# EAGLE design Modular-LED-Lamp-Power-Control (EAGLE 7.7.0)
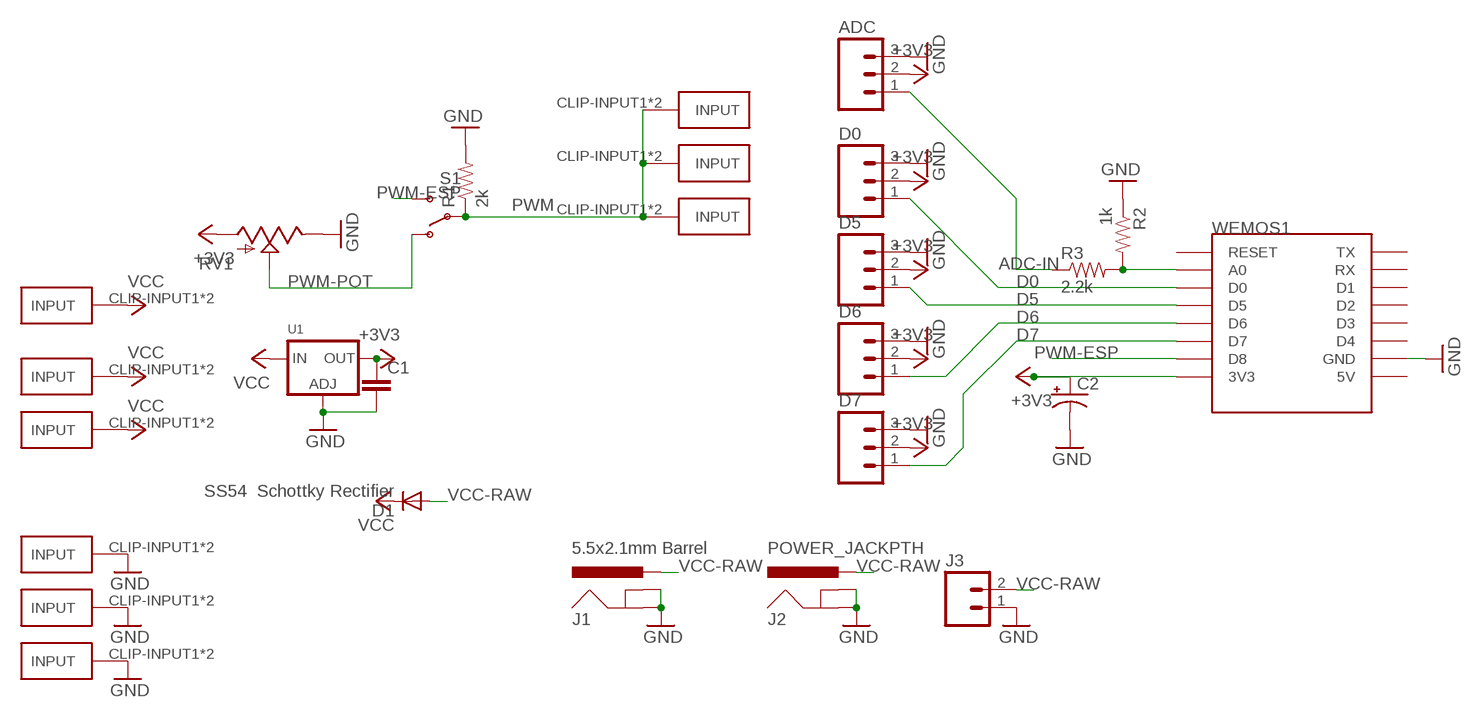
[diagram p0: schematic, sheet 1]

## Parts
ADC  M03PTH  [1X03]
C1  CAP1206  [1206]
C2  CAP_POLE  [PANASONIC_E]
D0  M03PTH  [1X03]
D1  SS54 Schottky Rectifier  S3A  [DO214AB]
D5  M03PTH  [1X03]
D6  M03PTH  [1X03]
D7  M03PTH  [1X03]
GND-CLIP  GND  FUSE-HOLDER-5X20MM  [FUSE-HOLDER-5X20MM]
GND-CLIP1  GND  FUSE-HOLDER-5X20MM  [FUSE-HOLDER-5X20MM]
GND-CLIP2  GND  FUSE-HOLDER-5X20MM  [FUSE-HOLDER-5X20MM]
J1  5.5x2.1mm Barrel  POWER_JACKSMD  [POWER_JACK_SMD]
J2  POWER_JACKPTH  [POWER_JACK_PTH]
J3  M025MM  [SCREWTERMINAL-5MM-2]
PWM-CLIP  FUSE-HOLDER-5X20MM  [FUSE-HOLDER-5X20MM]
PWM-CLIP1  FUSE-HOLDER-5X20MM  [FUSE-HOLDER-5X20MM]
PWM-CLIP2  FUSE-HOLDER-5X20MM  [FUSE-HOLDER-5X20MM]
R1  2k  RESISTOR1206  [1206]
R2  1k  RESISTOR1206  [1206]
R3  2.2k  RESISTOR1206  [1206]
RV1  POT-RV16AF-20  [POT_ALPHA_RV16AF-20]
S1  SWITCH-SPDTPTH  [SWITCH-SPDT]
U1  LM1117SOT223-WAVE  [SOT223-W]
VCC-CLIP  FUSE-HOLDER-5X20MM  [FUSE-HOLDER-5X20MM]
VCC-CLIP1  FUSE-HOLDER-5X20MM  [FUSE-HOLDER-5X20MM]
VCC-CLIP2  FUSE-HOLDER-5X20MM  [FUSE-HOLDER-5X20MM]
WEMOS1  WEMOS-D1-MINI  [WEMOS-D1-MINI]

## Nets
+3V3: ADC.2 C1.1 C2.+ D0.2 D5.2 D6.2 D7.2 RV1.1(A) U1.2(OUT) WEMOS1.3V3
A0: R2.2 R3.2 WEMOS1.A0
ADC-IN: ADC.1 R3.1
D0: D0.1 WEMOS1.D0
D5: D5.1 WEMOS1.D5
D6: D6.1 WEMOS1.D6
D7: D7.1 WEMOS1.D7
GND: ADC.3 C1.2 C2.- D0.3 D5.3 D6.3 D7.3 GND-CLIP1.CLIP-INPUT1(INPUT) GND-CLIP1.CLIP-INPUT2(INPUT) GND-CLIP2.CLIP-INPUT1(INPUT) GND-CLIP2.CLIP-INPUT2(INPUT) GND-CLIP.CLIP-INPUT1(INPUT) GND-CLIP.CLIP-INPUT2(INPUT) J1.GND(GNDBREAK) J1.P$4(GND) J2.GND J2.GNDBREAK J3.1 R1.2 R2.1 RV1.3(E) U1.1(ADJ) WEMOS1.GND
PWM: PWM-CLIP1.CLIP-INPUT1(INPUT) PWM-CLIP1.CLIP-INPUT2(INPUT) PWM-CLIP2.CLIP-INPUT1(INPUT) PWM-CLIP2.CLIP-INPUT2(INPUT) PWM-CLIP.CLIP-INPUT1(INPUT) PWM-CLIP.CLIP-INPUT2(INPUT) R1.1 S1.2(P)
PWM-ESP: S1.3(S) WEMOS1.D8
PWM-POT: RV1.2(S) S1.1(O)
VCC: D1.C U1.3(IN) VCC-CLIP1.CLIP-INPUT1(INPUT) VCC-CLIP1.CLIP-INPUT2(INPUT) VCC-CLIP2.CLIP-INPUT1(INPUT) VCC-CLIP2.CLIP-INPUT2(INPUT) VCC-CLIP.CLIP-INPUT1(INPUT) VCC-CLIP.CLIP-INPUT2(INPUT)
VCC-RAW: D1.A J1.VIN0(PWR) J2.PWR J3.2
Unconnected: WEMOS1.5V WEMOS1.D1 WEMOS1.D2 WEMOS1.D3 WEMOS1.D4 WEMOS1.RESET WEMOS1.RX WEMOS1.TX

## Library data of the parts
ADC D0 D5-D7 = SparkFun-Connectors:M03: Header 3 Standard 3-pin 0.1" header. Use with straight break away headers (SKU : PRT-00116), right angle break away headers (PRT-00553), swiss pins (PRT-00743), machine pins (PRT-00117), and female headers (PRT-00115). Molex polarized connector foot print use with SKU : PRT-08232 with associated crimp pins and housings.
C1 = SparkFun-Capacitors:CAP: Capacitor Standard 0603 ceramic capacitor, and 0.1" leaded capacitor.
C2 = SparkFun-Capacitors:CAP_POL: Capacitor Polarized These are standard SMD and PTH capacitors. Normally 10uF, 47uF, and 100uF in electrolytic and tantalum varieties. Always verify the external diameter of the through hole cap, it varies with capacity, voltage, and manufacturer. The EIA devices should be standard.
D1 = s3x_10:S3*: S3A - S3N General Purpose Rectifiers Source: http://www.fairchildsemi.com/datasheets/S3/S3A.pdf; MF: Fairchild; MPN: S3A; OC_FARNELL: 1017803; OC_NEWARK: 58K2395
GND-CLIP GND-CLIP1 GND-CLIP2 PWM-CLIP PWM-CLIP1 PWM-CLIP2 VCC-CLIP VCC-CLIP1 VCC-CLIP2 = timon-diverses:FUSE-HOLDER-5X20MM
J1 = SparkFun-Connectors:POWER_JACK: Power Jack This is the standard 5.5mm barrel jack for power. The PTH is the most common, proven, reliable, footprint. The Slot footprint only works if the mill layer is transmitted to the PCB fab house so be warned. Mating wall wart : TOL-00298 (and others); PROD_ID: CONN-08106; SF_ID: PRT-12748
J2 = SparkFun-Connectors:POWER_JACK: Power Jack This is the standard 5.5mm barrel jack for power. The PTH is the most common, proven, reliable, footprint. The Slot footprint only works if the mill layer is transmitted to the PCB fab house so be warned. Mating wall wart : TOL-00298 (and others); PROD_ID: CONN-08197
J3 = SparkFun-Connectors:M02: Standard 2-pin 0.1" header. Use with - straight break away headers ( PRT-00116) - right angle break away headers (PRT-00553) - swiss pins (PRT-00743) - machine pins (PRT-00117) - female headers (PRT-00115) Molex polarized connector foot print use with: PRT-08233 with associated crimp pins and housings. 2.54_SCREWTERM for use with PRT-10571. 3.5mm Screw Terminal footprints for PRT-08084 5mm Screw Terminal footprints for use with PRT-08432; STOREFRONT_ID: PRT-08432
R1-R3 = SparkFun-Resistors:RESISTOR: Resistor Basic schematic elements and footprints for 0603, 1206, and PTH resistors.
RV1 = SparkFun-Electromechanical:POT
S1 = SparkFun-Electromechanical:SWITCH-SPDT: SPDT Switch Simple slide switch, Spark Fun Electronics SKU : COM-00102 DPDT SMT slide switch, AYZ0202, SWCH-08179; PROD_ID: SWCH-08261
U1 = microbuilder:LM1117: LM1117 Voltage Regulator LM1117 Adjustable Voltage regulator [Digikey: LM1117IMP-ADJDKR-ND] LM1117 3.3V Voltage regulator [AP1117E33GDIDKR-ND] LM1117 5.0V Voltage regulator [AP1117E50GDIDKR-ND] SOT223-REFLOW - SOT223 package for solder paste/reflow ovens SOT223-WAVE - SOT223 package for hand-soldering (larger pads) Note: For the fixed-voltage regulators, simply set the ADJ pin to GND.
WEMOS1 = esp8266modules:WEMOS-D1-MINI: WeMos.cc D1 mini ESP8266 module

## Board
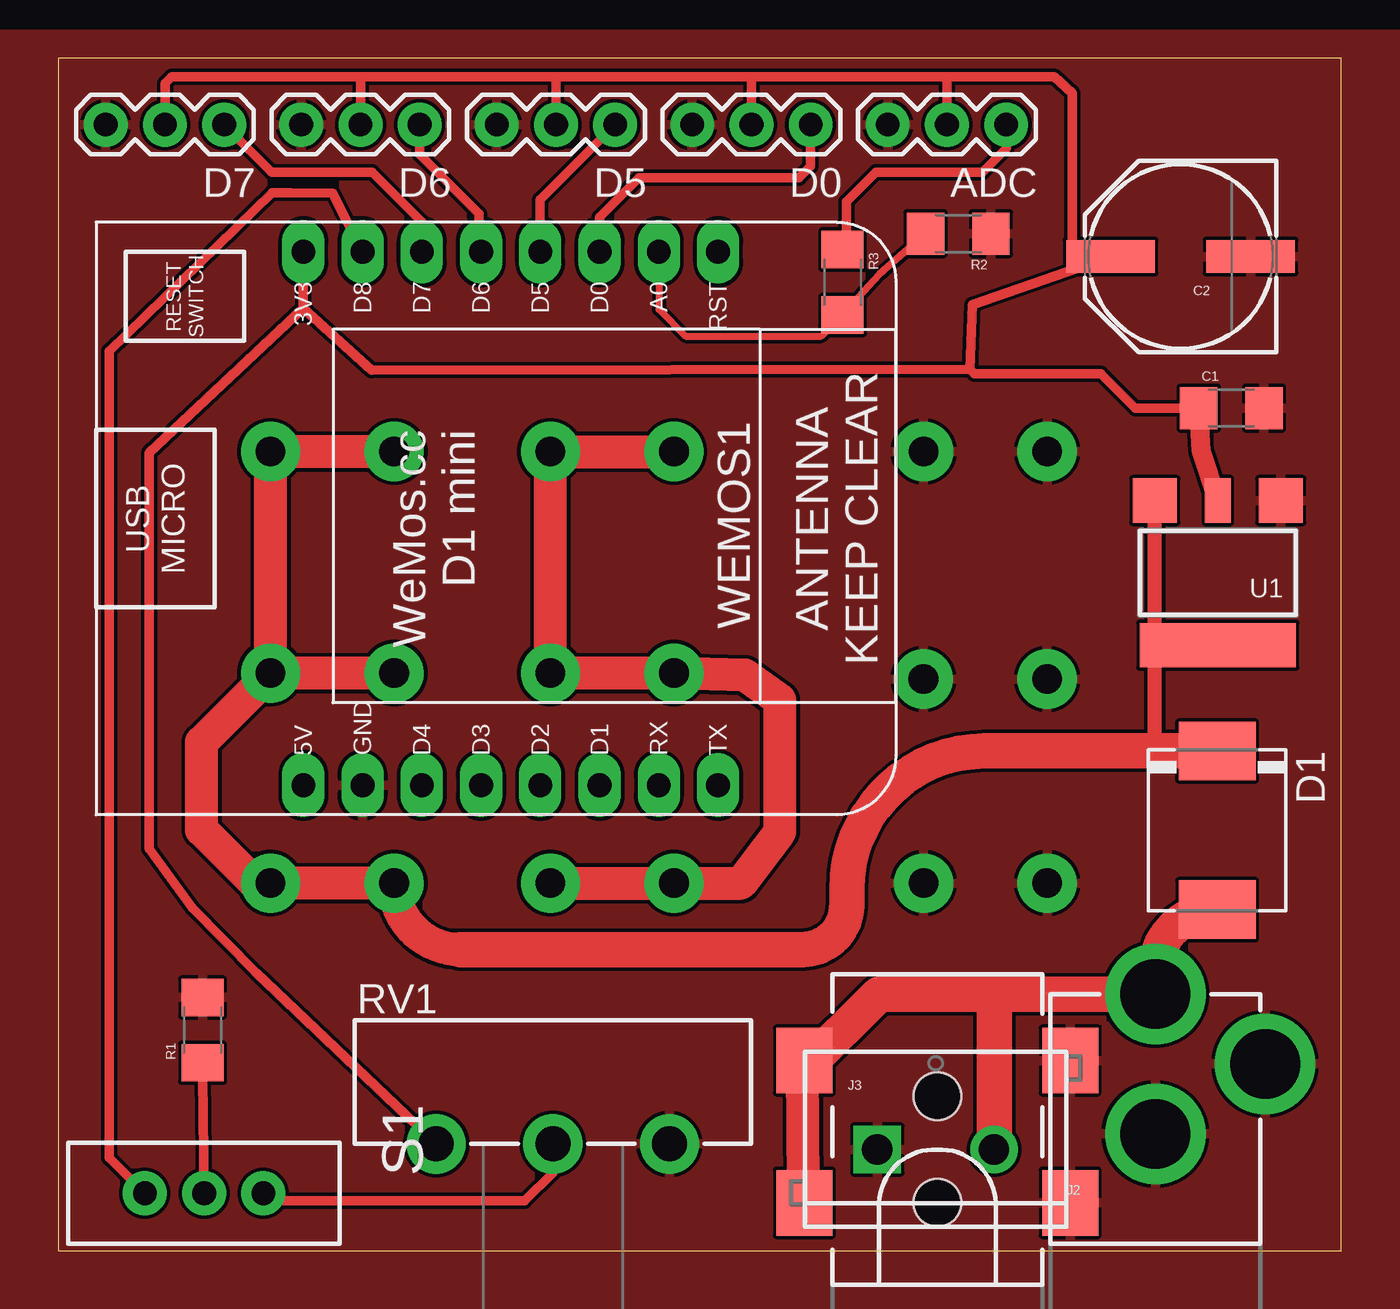
[diagram p1: board, top side]
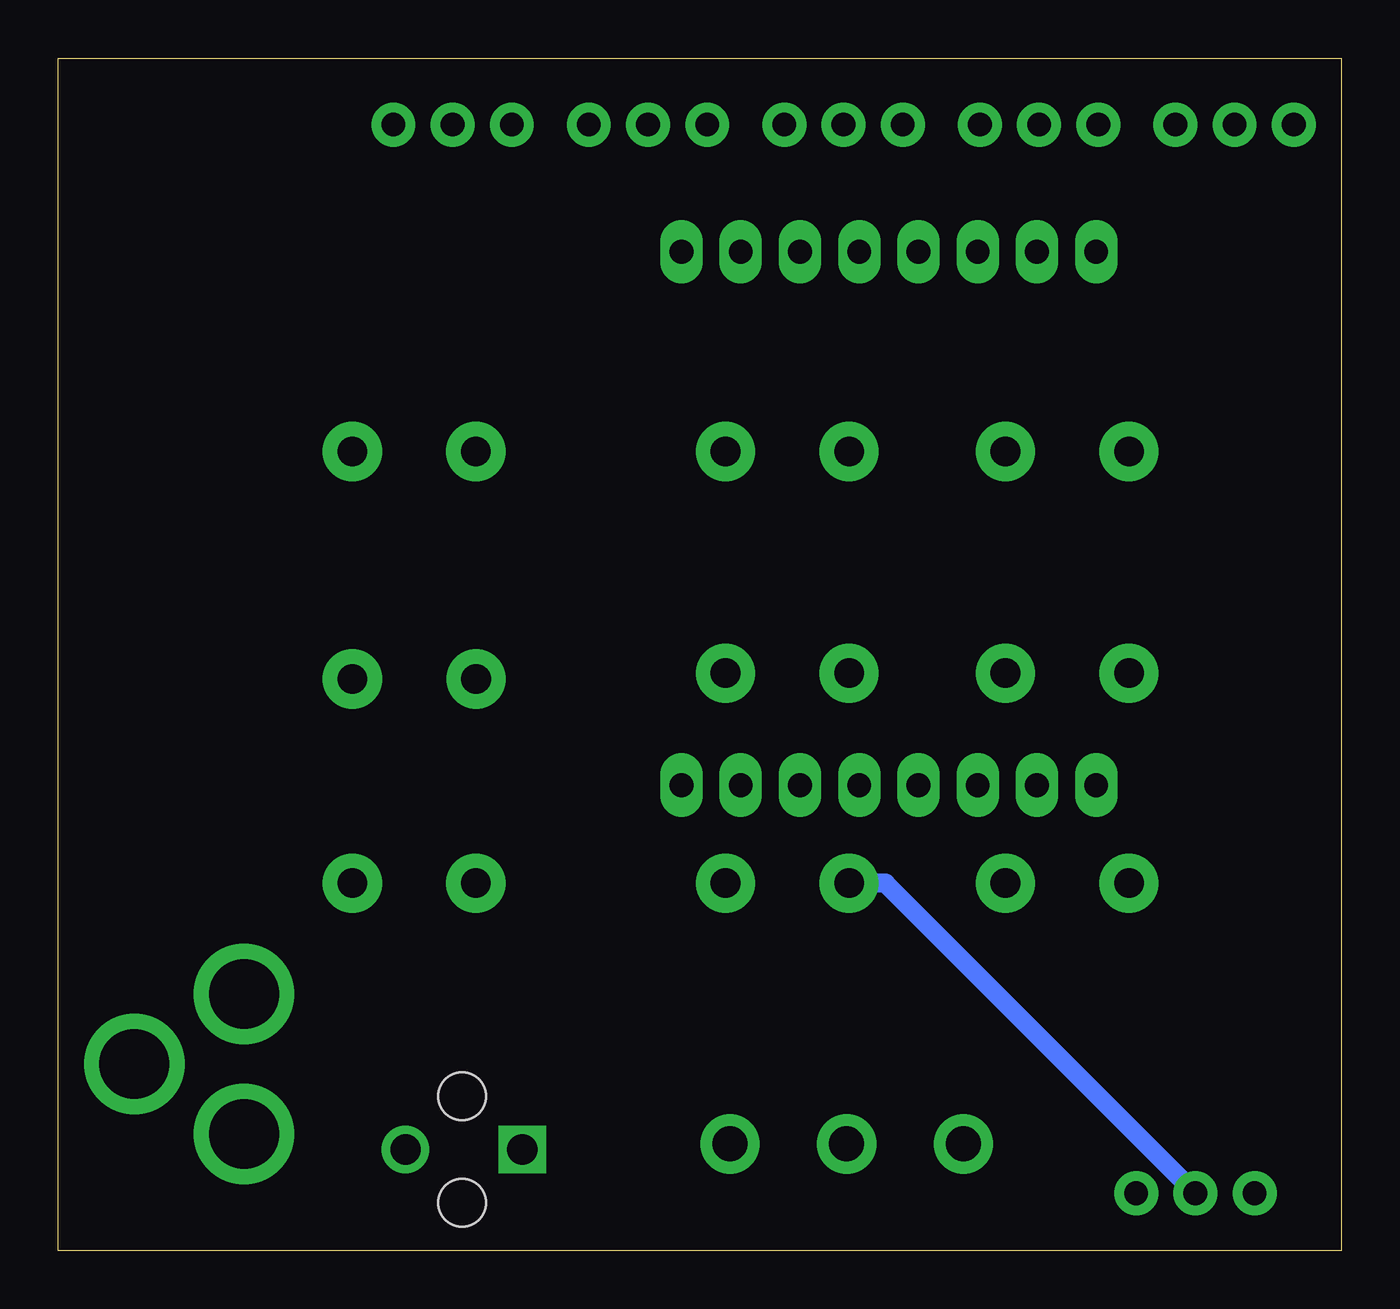
[diagram p2: board, bottom side, seen from below]

Size 55 x 51.1 mm. Coordinates in mm from the lower left corner, seen from the top.
Outline: 0,0 55,0 55,51.1 0,51.1 0,0
Copper layers (1*16): Top 0.035mm / dielectric 1.5mm / Bottom 0.035mm
Design rules "OthermillDRC_30_deg_v2": minimum track width 6mil, minimum drill 0.8mm, track to track 6mil, track to pad 6mil, pad to pad 6mil, via to via 6mil, smd to smd 0mil, copper to edge 0mil, drill to drill 6mil, minimum pad ring 10mil, minimum via ring 10mil, stop-mask expansion 1mil, vias tented up to drill 30mil, thermal gap 6mil

### Footprints (pad centres in the part's own frame; a part is rotated, then mirrored left to right if it is on the bottom)
1X03 = drill 1.016 pad 1.88: 1 0,0; 2 2.54,0; 3 5.08,0
1206 = smd 1.6 x 1.8: 1 -1.4,0; 2 1.4,0
PANASONIC_E = smd 3.8 x 1.4: + 3,0; - -3,0
DO214AB = smd 2.5 x 3.3: A 3.4,0; C -3.4,0
FUSE-HOLDER-5X20MM = drill 1.27 pad 2.54: CLIP-INPUT1 -2.65,0; CLIP-INPUT2 2.65,0
POWER_JACK_SMD = smd 2.8 x 2.4: GND 0,-5.7; P$4 6.1,-5.7; VIN0 0,5.7; VIN1 6.1,5.7 | hole 2.032: 0,0; 4.572,0
POWER_JACK_PTH = drill 2.997 pad 4.318: GND 0,7.7; GNDBREAK 4.7,10.7; PWR 0,13.7
SCREWTERMINAL-5MM-2 = drill 1.3 pad 2.032 square: 1 0,0 | drill 1.3 pad 2.032: 2 5,0
POT_ALPHA_RV16AF-20 = drill 1.5 pad 2.54: 1 -5,0; 2 0,0; 3 5,0
SWITCH-SPDT = drill 1.016 pad 1.88: 1 0,2.54; 2 0,0; 3 0,-2.54
SOT223-W = smd 1.9 x 1.9: 1 -2.7,-3.1; 3 2.7,-3.1 | smd 1.1 x 1.9: 2 0,-3.1 | smd 6.7 x 1.9: 4 0,3.1
WEMOS-D1-MINI = drill 1.016 pad 1.829 long: 3V3 -10.16,-10.16; 5V 12.7,-10.16; A0 -10.16,5.08; D0 -10.16,2.54; D1 12.7,2.54; D2 12.7,0; D3 12.7,-2.54; D4 12.7,-5.08; D5 -10.16,0; D6 -10.16,-2.54; D7 -10.16,-5.08; D8 -10.16,-7.62; GND 12.7,-7.62; RESET -10.16,7.62; RX 12.7,5.08; TX 12.7,7.62

### Placement (x,y rotation side)
ADC  40.64,48.26 180 top
C1  50.29,36.12 0 top
C2  48.12,42.61 180 top
D0  32.26,48.26 180 top
D1  49.69,18.02 270 top
D5  23.88,48.26 180 top
D6  15.49,48.26 180 top
D7  7.11,48.26 180 top
GND-CLIP  39.75,34.25 0 top
GND-CLIP1  39.74,24.5 0 top
GND-CLIP2  39.75,15.75 0 top
J1  37.69,2.05 90 top
J2  47.04,-2.7 0 top
J3  35.12,4.33 0 top
PWM-CLIP  23.75,34.25 0 top
PWM-CLIP1  23.75,24.75 0 top
PWM-CLIP2  23.75,15.75 0 top
R1  6.19,9.45 90 top
R2  38.58,43.59 180 top
R3  33.63,41.5 270 top
RV1  21.2,4.57 0 top
S1  6.25,2.46 270 top
U1  49.71,29.05 180 top
VCC-CLIP  11.75,34.25 0 top
VCC-CLIP1  11.75,24.75 180 top
VCC-CLIP2  11.75,15.75 0 top
WEMOS1  20.66,32.65 270 top

### Tracks (layer width: path | path; a pad name or v marks a point on that pad's centre or on a via)
+3V3
  Top 0.406: RV1.1 8.48,11.91 5.74,14.71 3.89,17.22 3.89,34.19 10.51,40.4 | 10.51,40.4 WEMOS1.3V3 | 10.51,40.4 13.43,37.74 39.08,37.78 | C2.+ 43.76,42.13 | 43.76,42.13 39.19,40.55 39.08,37.78 | 29.72,50.32 38.1,50.32 | 38.1,50.32 42.7,50.32 43.48,49.61 43.48,42.41 43.76,42.13 | D0.2 29.72,50.32 | 29.72,50.32 21.34,50.32 | 21.34,50.32 12.95,50.32 | 12.95,50.32 4.85,50.32 4.57,50.04 D7.2 | D5.2 21.34,50.32 | ADC.2 38.1,50.32 | D6.2 12.95,50.32 | C1.1 46.18,36.12 44.7,37.59 39.27,37.59 39.08,37.78
  Top 0.813: U1.2 49,34.29 C1.1
A0
  Top 0.305: R2.2 35.2,41.84 R3.2 32.72,39.19 26.9,39.19 25.75,40.35 WEMOS1.A0
ADC-IN
  Top 0.406: ADC.1 40.64,47.24 39.62,46.23 35.05,46.23 33.78,44.96 33.78,43.06 R3.1
D0
  Top 0.406: WEMOS1.D0 23.2,44.29 24.89,45.97 31.75,45.97 32.26,46.48 D0.1
D5
  Top 0.406: WEMOS1.D5 20.66,45.05 D5.1
D6
  Top 0.406: D6.1 15.49,46.99 18.03,44.45 18.03,42.9 WEMOS1.D6
D7
  Top 0.406: WEMOS1.D7 15.59,44.1 13.46,46.23 9.14,46.23 D7.1
GND
  pour Top: -5.08,-5.08 60.1,-5.08 60.1,52.14 -5.08,52.14
PWM
  Top 0.406: S1.2 6.2,7.43 R1.1
  Top 1.422: PWM-CLIP2.CLIP-INPUT1 PWM-CLIP2.CLIP-INPUT2 29.26,15.75 30.94,17.96 30.94,23.6 29.44,24.66 PWM-CLIP1.CLIP-INPUT2 PWM-CLIP1.CLIP-INPUT1 PWM-CLIP.CLIP-INPUT1 PWM-CLIP.CLIP-INPUT2
  Bottom 0.813: S1.2 19.54,15.75 PWM-CLIP2.CLIP-INPUT1
PWM-ESP
  Top 0.406: S1.3 2.18,3.99 2.18,38.56 9.17,45.34 9.96,45.34 11.76,45.31 13.03,42.83 WEMOS1.D8
PWM-POT
  Top 0.406: RV1.2 21.2,3.35 19.99,2.13 9.12,2.13 S1.1
VCC
  Top 0.61: D1.C 47.01,21.41 U1.3
  Top 1.422: 17.25,12.9 arc-90 VCC-CLIP2.CLIP-INPUT2 VCC-CLIP2.CLIP-INPUT1 8.43,15.75 6.15,18.03 6.15,21.8 VCC-CLIP1.CLIP-INPUT2 | VCC-CLIP1.CLIP-INPUT2 VCC-CLIP.CLIP-INPUT1 VCC-CLIP.CLIP-INPUT2 | VCC-CLIP1.CLIP-INPUT1 VCC-CLIP1.CLIP-INPUT2
  Top 1.524: D1.C 39.73,21.41 arc90 33.81,15.49 33.81,14.81 arc-90 31.9,12.9 17.25,12.9 arc90 17.25,12.9
VCC-RAW
  Top 1.422: 40.13,11 40.41,11 | J1.VIN0 31.94,2.83 31.9,7.77 31.75,8.69 31.95,7.77
  Top 1.524: J3.2 40.13,4.35 40.13,11 | 31.95,7.77 35.18,11 40.41,11 J2.PWR 47.04,11.97 arc-90 D1.A